# EAGLE design sch (EAGLE 9.4.0)
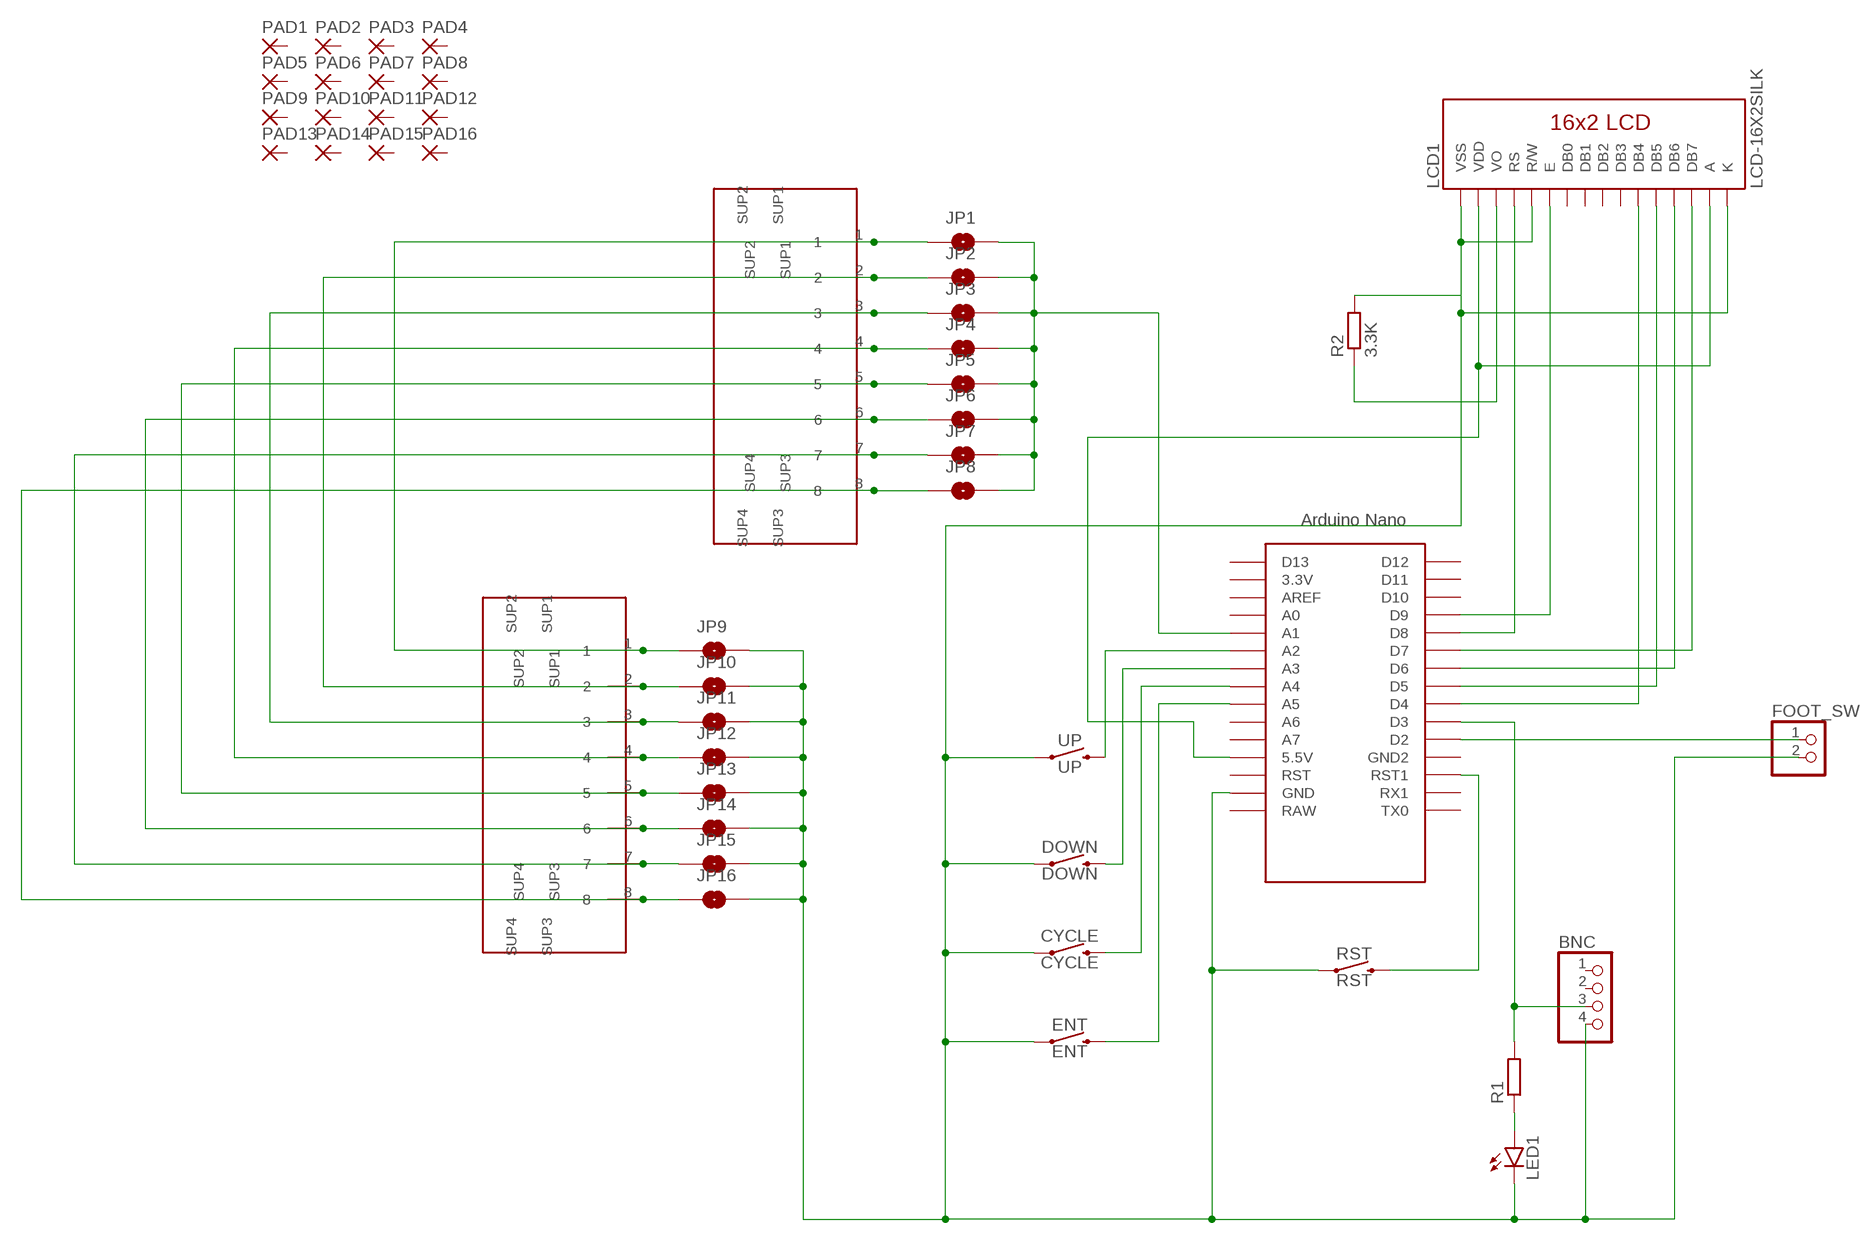
[diagram p0: schematic, sheet 1]

## Parts
BNC  PINHD-1X4  [1X04]
CYCLE  CYCLE  MOMENTARY-SWITCH-SPST-PTH-6.0MM  [TACTILE_SWITCH_PTH_6.0MM]
DOWN  DOWN  MOMENTARY-SWITCH-SPST-PTH-6.0MM  [TACTILE_SWITCH_PTH_6.0MM]
ENT  ENT  MOMENTARY-SWITCH-SPST-PTH-6.0MM  [TACTILE_SWITCH_PTH_6.0MM]
FOOT_SW  PINHD-1X2  [1X02]
JP1  JUMPER-SMT_2_NO_SILK  [SMT-JUMPER_2_NO_SILK]
JP2  JUMPER-SMT_2_NO_SILK  [SMT-JUMPER_2_NO_SILK]
JP3  JUMPER-SMT_2_NO_SILK  [SMT-JUMPER_2_NO_SILK]
JP4  JUMPER-SMT_2_NO_SILK  [SMT-JUMPER_2_NO_SILK]
JP5  JUMPER-SMT_2_NO_SILK  [SMT-JUMPER_2_NO_SILK]
JP6  JUMPER-SMT_2_NO_SILK  [SMT-JUMPER_2_NO_SILK]
JP7  JUMPER-SMT_2_NO_SILK  [SMT-JUMPER_2_NO_SILK]
JP8  JUMPER-SMT_2_NO_SILK  [SMT-JUMPER_2_NO_SILK]
JP9  JUMPER-SMT_2_NO_SILK  [SMT-JUMPER_2_NO_SILK]
JP10  JUMPER-SMT_2_NO_SILK  [SMT-JUMPER_2_NO_SILK]
JP11  JUMPER-SMT_2_NO_SILK  [SMT-JUMPER_2_NO_SILK]
JP12  JUMPER-SMT_2_NO_SILK  [SMT-JUMPER_2_NO_SILK]
JP13  JUMPER-SMT_2_NO_SILK  [SMT-JUMPER_2_NO_SILK]
JP14  JUMPER-SMT_2_NO_SILK  [SMT-JUMPER_2_NO_SILK]
JP15  JUMPER-SMT_2_NO_SILK  [SMT-JUMPER_2_NO_SILK]
JP16  JUMPER-SMT_2_NO_SILK  [SMT-JUMPER_2_NO_SILK]
LAN1  RJ45  [RJ45]
LAN2  RJ45  [RJ45]
LCD1  LCD-16X2SILK  [LCD-16X2]
LED1  LED5MM  [LED5MM]
PAD1  1,6/0,8  [1,6/0,8]
PAD2  1,6/0,8  [1,6/0,8]
PAD3  1,6/0,8  [1,6/0,8]
PAD4  1,6/0,8  [1,6/0,8]
PAD5  1,6/0,8  [1,6/0,8]
PAD6  1,6/0,8  [1,6/0,8]
PAD7  1,6/0,8  [1,6/0,8]
PAD8  1,6/0,8  [1,6/0,8]
PAD9  1,6/0,8  [1,6/0,8]
PAD10  1,6/0,8  [1,6/0,8]
PAD11  1,6/0,8  [1,6/0,8]
PAD12  1,6/0,8  [1,6/0,8]
PAD13  1,6/0,8  [1,6/0,8]
PAD14  1,6/0,8  [1,6/0,8]
PAD15  1,6/0,8  [1,6/0,8]
PAD16  1,6/0,8  [1,6/0,8]
R1  R-EU_0207/7  [0207/7]
R2  3.3K  R-EU_0207/7  [0207/7]
RST  RST  MOMENTARY-SWITCH-SPST-PTH-6.0MM  [TACTILE_SWITCH_PTH_6.0MM]
U$1  NANO  [NANO]
UP  UP  MOMENTARY-SWITCH-SPST-PTH-6.0MM  [TACTILE_SWITCH_PTH_6.0MM]

## Nets
N$1: LCD1.4(RS) U$1.D8
N$2: LCD1.6(E) U$1.D9
N$3: LCD1.11(DB4) U$1.D4
N$4: LCD1.12(DB5) U$1.D5
N$5: LCD1.13(DB6) U$1.D6
N$6: LCD1.14(DB7) U$1.D7
N$7: BNC.3 R1.2 U$1.D3
N$8: LED1.A R1.1
N$9: U$1.A2 UP.3
N$10: JP1.2 JP2.2 JP3.2 JP4.2 JP5.2 JP6.2 JP7.2 JP8.2 U$1.A1
N$11: FOOT_SW.1 U$1.D2
N$12: LCD1.2(VDD) LCD1.15(A) U$1.5V(5.5V)
N$13: DOWN.3 U$1.A3
N$14: CYCLE.3 U$1.A4
N$15: ENT.3 U$1.A5
N$16: BNC.4 CYCLE.1 DOWN.1 ENT.1 FOOT_SW.2 JP9.2 JP10.2 JP11.2 JP12.2 JP13.2 JP14.2 JP15.2 JP16.2 LCD1.1(VSS) LCD1.5(R/W) LCD1.16(K) LED1.K(C) R2.2 RST.1 U$1.GND UP.1
N$17: RST.3 U$1.RST1
N$19: JP2.1 JP10.1 LAN1.2 LAN2.2
N$20: JP3.1 JP11.1 LAN1.3 LAN2.3
N$21: JP4.1 JP12.1 LAN1.4 LAN2.4
N$22: JP5.1 JP13.1 LAN1.5 LAN2.5
N$23: JP6.1 JP14.1 LAN1.6 LAN2.6
N$24: JP7.1 JP15.1 LAN1.7 LAN2.7
N$25: JP8.1 JP16.1 LAN1.8 LAN2.8
N$26: JP1.1 JP9.1 LAN1.1 LAN2.1
N$36: LCD1.3(VO) R2.1
Unconnected: BNC.1 BNC.2 LAN1.SUP1 LAN1.SUP2 LAN1.SUP3 LAN1.SUP4 LAN2.SUP1 LAN2.SUP2 LAN2.SUP3 LAN2.SUP4 LCD1.7(DB0) LCD1.8(DB1) LCD1.9(DB2) LCD1.10(DB3) PAD1.1(P) PAD2.1(P) PAD3.1(P) PAD4.1(P) PAD5.1(P) PAD6.1(P) PAD7.1(P) PAD8.1(P) PAD9.1(P) PAD10.1(P) PAD11.1(P) PAD12.1(P) PAD13.1(P) PAD14.1(P) PAD15.1(P) PAD16.1(P) U$1.3.3V U$1.A0 U$1.A6 U$1.A7 U$1.AREF U$1.D10 U$1.D11 U$1.D12 U$1.D13 U$1.GND1(GND2) U$1.ICSP1 U$1.ICSP2 U$1.ICSP3 U$1.ICSP4 U$1.ICSP5 U$1.ICSP6 U$1.RAW U$1.RST U$1.RX1 U$1.TX0

## Library data of the parts
BNC = pinhead:PINHD-1X4: PIN HEADER
CYCLE DOWN ENT RST UP = SparkFun-Switches:MOMENTARY-SWITCH-SPST: Momentary Switch (Pushbutton) - SPST Normally-open (NO) SPST momentary switches (buttons, pushbuttons). Variants PTH-12MM - 12mm square, through-hole Momentary Pushbutton Switch - 12mm Square <https://www.sparkfun.com/products/9190> (COM-09190) PTH-6.0MM, PTH-6.0MM-KIT - 6.0mm square, through-hole Mini Pushbutton Switch <https://www.sparkfun.com/products/97> (COM-00097) KIT package intended for soldering kit's - only one side of pads' copper is exposed. PTH-RIGHT-ANGLE-KIT - Right-angle, through-hole Right Angle Tactile Button <https://www.sparkfun.com/products/10791> - Used on SparkFun BigTime Watch Kit <https://www.sparkfun.com/products/11734> SMD-12MM - 12mm square, surface-mount Tactile Button - SMD (12mm) <https://www.sparkfun.com/products/12993> (COM-12993) Used on SparkFun PicoBoard <https://www.sparkfun.com/products/11888> SMD-4.5MM - 4.5mm Square Trackball Switch Used on SparkFun Blackberry Trackballer Breakout <https://www.sparkfun.com/products/13169> SMD-4.6MMX2.8MM - 4.60mm x 2.80mm, surface mount Used on SparkFun SAMD21 Mini Breakout <https://www.sparkfun.com/products/13664> SMD-5.2MM, SMD-5.2-REDUNDANT - 5.2mm square, surface-mount Mini Pushbutton Switch - SMD <https://www.sparkfun.com/products/8720> (COM-08720) Used on Arduino Pro Mini <https://www.sparkfun.com/products/11114> REDUNDANT package connects both switch circuits together SMD-6.0X3.5MM - 6.0 x 3.5mm, surface mount Momentary Reset Switch SMD <https://www.sparkfun.com/products/8229> (COM-08229) SMD-6.2MM-TALL - 6.2mm square, surface mount Tactile Button - SMD (6mm) <https://www.sparkfun.com/products/12992> Used on SparkFun Digital Sandbox <https://www.sparkfun.com/products/12651> SMD-RIGHT-ANGLE - Right-angle, surface mount Used on SparkFun Block for Intel® Edison - Arduino <https://www.sparkfun.com/products/13036>; PROD_ID: SWCH-08441; SF_SKU: COM-00097
FOOT_SW = pinhead:PINHD-1X2: PIN HEADER
JP1-JP16 = SparkFun-Jumpers:JUMPER-SMT_2_NO: Normally open jumper This jumper has two pads in close proximity to each other. Apply solder to close the connection. Round pads are easier to solder for beginners, but are a lot larger. SparkFun Product that uses the round pads: SparkFun EL Sequencer <https://www.sparkfun.com/products/12781>
LAN1 LAN2 = rj45:RJ45
LCD1 = SparkFun-Displays:LCD-16X2: Standard text-only 16x2 parallel input LCD Basic 16 character by 2 line display. Typically utilizes the extremely common HD44780 parallel interface chipset SparkFun Products: Basic 16x2 Green <https://www.sparkfun.com/products/255> Basic 8x2 Green <https://www.sparkfun.com/products/11122>; SF_ID: LCD-00255
LED1 = led:LED: LED OSRAM: - CHIPLED LG R971, LG N971, LY N971, LG Q971, LY Q971, LO R971, LY R971 LH N974, LH R974 LS Q976, LO Q976, LY Q976 LO Q996 - Hyper CHIPLED LW Q18S LB Q993, LB Q99A, LB R99A - SideLED LS A670, LO A670, LY A670, LG A670, LP A670 LB A673, LV A673, LT A673, LW A673 LH A674 LY A675 LS A676, LA A676, LO A676, LY A676, LW A676 LS A679, LY A679, LG A679 - Hyper Micro SIDELED® LS Y876, LA Y876, LO Y876, LY Y876 LT Y87S - SmartLED LW L88C, LW L88S LB L89C, LB L89S, LG L890 LS L89K, LO L89K, LY L89K LS L896, LA L896, LO L896, LY L896 - TOPLED LS T670, LO T670, LY T670, LG T670, LP T670 LSG T670, LSP T670, LSY T670, LOP T670, LYG T670 LG T671, LOG T671, LSG T671 LB T673, LV T673, LT T673, LW T673 LH T674 LS T676, LA T676, LO T676, LY T676, LB T676, LH T676, LSB T676, LW T676 LB T67C, LV T67C, LT T67C, LS T67K, LO T67K, LY T67K, LW E67C LS E67B, LA E67B, LO E67B, LY E67B, LB E67C, LV E67C, LT E67C LW T67C LS T679, LY T679, LG T679 LS T770, LO T770, LY T770, LG T770, LP T770 LB T773, LV T773, LT T773, LW T773 LH T774 LS E675, LA E675, LY E675, LS T675 LS T776, LA T776, LO T776, LY T776, LB T776 LHGB T686 LT T68C, LB T68C - Hyper Mini TOPLED® LB M676 - Mini TOPLED Santana® LG M470 LS M47K, LO M47K, LY M47K Source: http://www.osram.convergy.de LUXEON: - LUMILED® LXK2-PW12-R00, LXK2-PW12-S00, LXK2-PW14-U00, LXK2-PW14-V00 LXK2-PM12-R00, LXK2-PM12-S00, LXK2-PM14-U00 LXK2-PE12-Q00, LXK2-PE12-R00, LXK2-PE12-S00, LXK2-PE14-T00, LXK2-PE14-U00 LXK2-PB12-K00, LXK2-PB12-L00, LXK2-PB12-M00, LXK2-PB14-N00, LXK2-PB14-P00, LXK2-PB14-Q00 LXK2-PR12-L00, LXK2-PR12-M00, LXK2-PR14-Q00, LXK2-PR14-R00 LXK2-PD12-Q00, LXK2-PD12-R00, LXK2-PD12-S00 LXK2-PH12-R00, LXK2-PH12-S00 LXK2-PL12-P00, LXK2-PL12-Q00, LXK2-PL12-R00 Source: www.luxeon.com KINGBRIGHT: KA-3528ASYC Source: www.kingbright.com
PAD1-PAD16 = wirepad:1,6/0,8: THROUGH-HOLE PAD
R1 R2 = resistor:R-EU_: RESISTOR, European symbol
U$1 = Arduino-clone:NANO: Arduino Nano

## Net classes
0 default: width 0.254 mm, clearance 0.254 mm

## Board
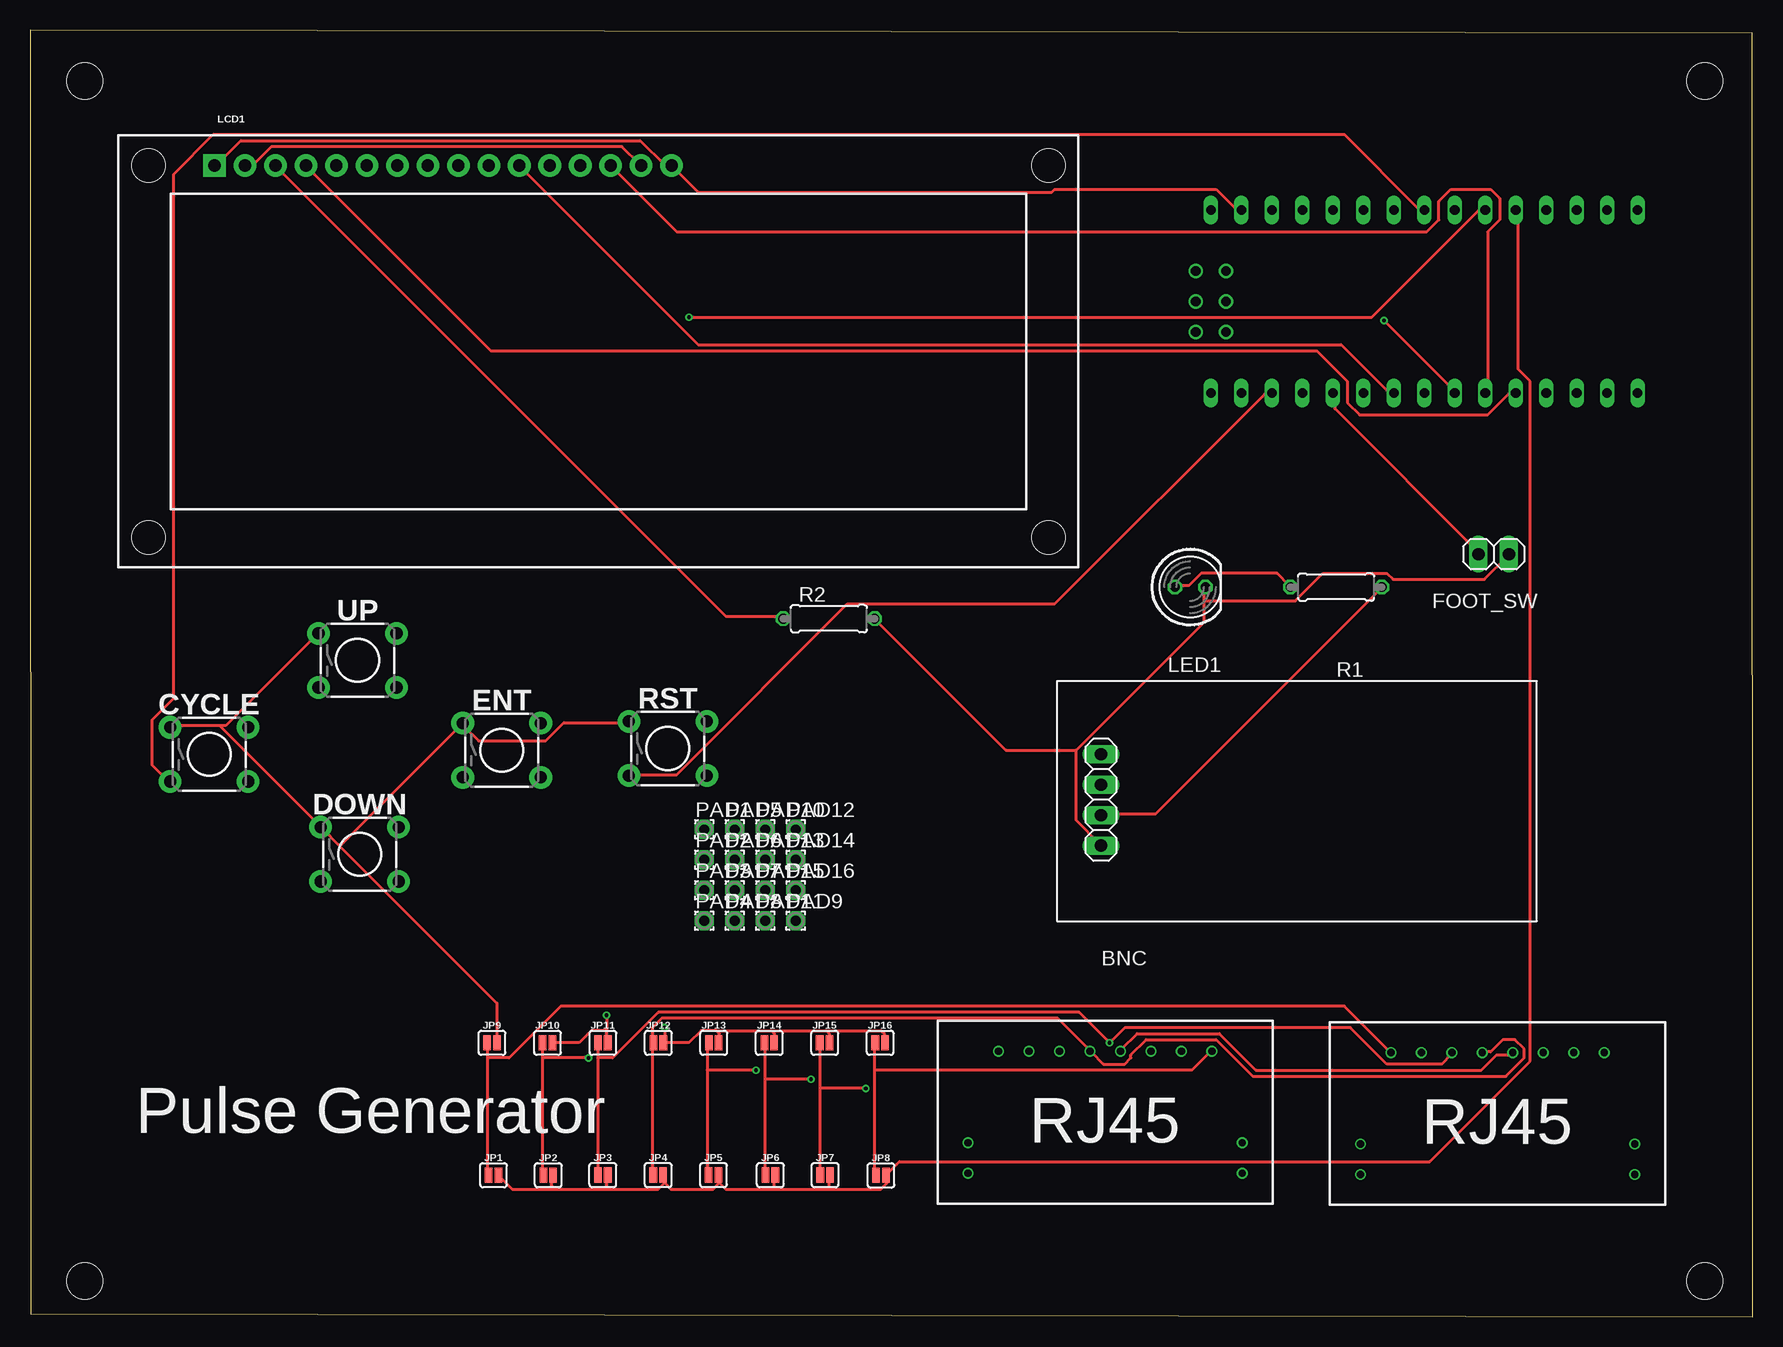
[diagram p1: board, top side]
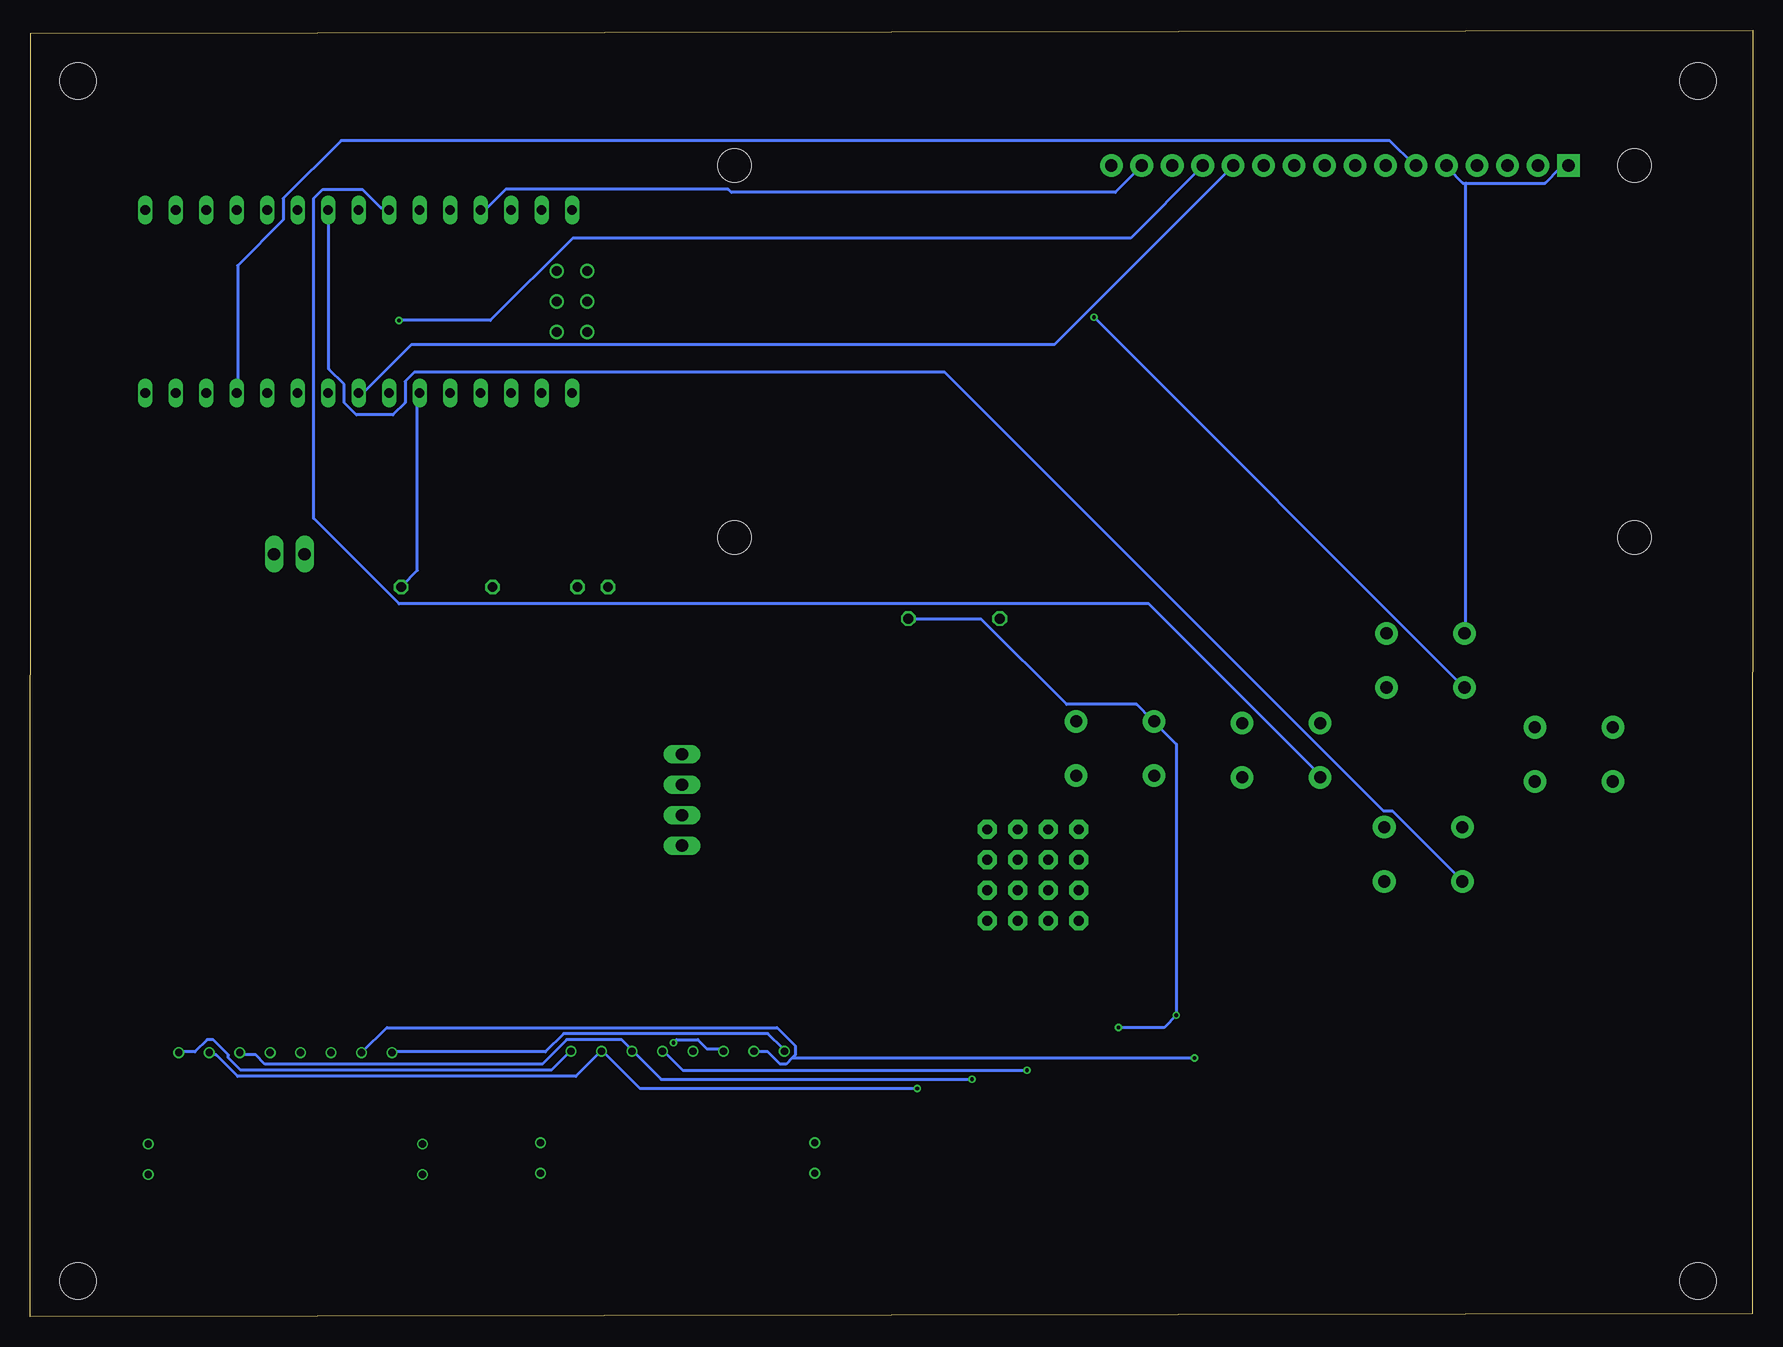
[diagram p2: board, bottom side, seen from below]

Size 143.58 x 107.22 mm. Coordinates in mm from the lower left corner, seen from the top.
Outline: 0.05,0.25 143.58,0 143.53,106.97 0,107.22 0.05,0.25
Copper layers (1*16): Top 0.035mm / dielectric 1.6mm / Bottom 0.035mm
Design rules "Elecrow_2-layer_PCB_eagle_rule": minimum track width 6mil, minimum drill 12mil, track to track 6mil, track to pad 6mil, pad to pad 6mil, via to via 8mil, smd to smd 0mil, copper to edge 20mil, drill to drill 10mil, minimum pad ring 6mil, minimum via ring 6mil, stop-mask expansion 0mil, vias tented up to drill 100mil, thermal gap 10mil
Holes 3 mm at 4.57,102.97 4.57,2.97 139.57,102.97 139.57,2.97

### Footprints (pad centres in the part's own frame; a part is rotated, then mirrored left to right if it is on the bottom)
1X04 = drill 1.016 long: 1 -3.81,0; 2 -1.27,0; 3 1.27,0; 4 3.81,0
TACTILE_SWITCH_PTH_6.0MM = drill 1.016 pad 1.88: 1 -3.251,2.261; 2 3.251,2.261; 3 -3.251,-2.261; 4 3.251,-2.261
1X02 = drill 1.016 long: 1 -1.27,0; 2 1.27,0
SMT-JUMPER_2_NO_SILK = smd 0.635 x 1.27: 1 -0.406,0; 2 0.406,0
RJ45 = drill 0.6: 1 2.54,2.54; 2 5.08,2.54; 3 7.62,2.54; 4 10.16,2.54; 5 12.7,2.54; 6 15.24,2.54; 7 17.78,2.54; 8 20.32,2.54; SUP1 0,-5.08; SUP2 0,-7.62; SUP3 22.86,-5.08; SUP4 22.86,-7.62
LCD-16X2 = drill 1.016 pad 1.88 square: 1 -32,15.5 | drill 1.016 pad 1.88: 2 -29.46,15.5; 3 -26.92,15.5; 4 -24.38,15.5; 5 -21.84,15.5; 6 -19.3,15.5; 7 -16.76,15.5; 8 -14.22,15.5; 9 -11.68,15.5; 10 -9.14,15.5; 11 -6.6,15.5; 12 -4.06,15.5; 13 -1.52,15.5; 14 1.02,15.5; 15 3.56,15.5; 16 6.1,15.5 | hole 2.8: -37.5,15.5; -37.5,-15.5; 37.5,15.5; 37.5,-15.5
LED5MM = drill 0.813 octagon: A -1.27,0; K 1.27,0
1,6/0,8 = drill 0.813 pad 1.6 octagon: 1 0,0
0207/7 = drill 0.813 octagon: 1 -3.81,0; 2 3.81,0
NANO = drill 0.8 long: 3.3V -10.16,24.13; 5V -10.16,-1.27; A0 -10.16,19.05; A1 -10.16,16.51; A2 -10.16,13.97; A3 -10.16,11.43; A4 -10.16,8.89; A5 -10.16,6.35; A6 -10.16,3.81; A7 -10.16,1.27; AREF -10.16,21.59; D2 5.08,1.27; D3 5.08,3.81; D4 5.08,6.35; D5 5.08,8.89; D6 5.08,11.43; D7 5.08,13.97; D8 5.08,16.51; D9 5.08,19.05; D10 5.08,21.59; D11 5.08,24.13; D12 5.08,26.67; D13 -10.16,26.67; GND -10.16,-6.35; GND1 5.08,-1.27; RAW -10.16,-8.89; RST -10.16,-3.81; RST1 5.08,-3.81; RX1 5.08,-6.35; TX0 5.08,-8.89 | drill 0.8: ICSP1 -5.08,-10.16; ICSP2 -5.08,-7.62; ICSP3 -2.54,-10.16; ICSP4 -2.54,-7.62; ICSP5 0,-10.16; ICSP6 0,-7.62

### Placement (x,y rotation side)
BNC  89.24,43.07 270 top
CYCLE  14.93,46.86 0 top
DOWN  27.47,38.53 0 top
ENT  39.31,47.2 0 top
FOOT_SW  121.97,63.55 0 top
JP1  38.63,11.79 0 top
JP2  43.18,11.79 0 top
JP3  47.73,11.8 0 top
JP4  52.35,11.8 0 top
JP5  56.96,11.8 0 top
JP6  61.7,11.8 0 top
JP7  66.26,11.8 0 top
JP8  70.92,11.78 0 top
JP9  38.5,22.82 0 top
JP10  43.12,22.82 0 top
JP11  47.74,22.82 0 top
JP12  52.36,22.82 0 top
JP13  56.98,22.82 0 top
JP14  61.6,22.82 0 top
JP15  66.22,22.82 0 top
JP16  70.84,22.82 0 top
LAN1  110.87,19.47 0 top
LAN2  78.17,19.57 0 top
LCD1  47.37,80.44 0 top
LED1  96.68,60.8 0 top
PAD1  56.18,40.61 0 top
PAD2  56.18,38.07 0 top
PAD3  56.18,35.53 0 top
PAD4  56.18,32.99 0 top
PAD5  58.72,40.61 0 top
PAD6  58.72,38.07 0 top
PAD7  58.72,35.53 0 top
PAD8  58.72,32.99 0 top
PAD9  63.8,32.99 0 top
PAD10  61.26,40.61 0 top
PAD11  61.26,32.99 0 top
PAD12  63.8,40.61 0 top
PAD13  61.26,38.07 0 top
PAD14  63.8,38.07 0 top
PAD15  61.26,35.53 0 top
PAD16  63.8,35.53 0 top
R1  108.84,60.8 0 top
R2  66.57,58.17 0 top
RST  53.15,47.35 0 top
U$1  107.3,82.06 270 top
UP  27.29,54.69 0 top

### Tracks (layer width: path | path; a pad name or v marks a point on that pad's centre or on a via)
N$1
  Top 0.254: U$1.D8 123.75,76.93 123.24,76.93 121.46,75.15 110.79,75.15 109.78,76.17 109.78,77.95 107.24,80.49 38.4,80.49 23.16,95.73 LCD1.4
N$2
  Bottom 0.254: U$1.D9 126.29,77.18 126.29,87.6 122.48,91.41 122.48,93.19 117.65,98.01 30.27,98.01 28.24,95.98 LCD1.6
N$3
  Top 0.254: U$1.D4 113.59,77.18 113.08,77.18 109.27,80.99 55.67,80.99 40.94,95.73 LCD1.11
N$4
  Bottom 0.254: U$1.D5 116.13,77.18 115.62,77.18 111.81,80.99 58.21,80.99 43.48,95.73 LCD1.12
N$5  (via drill 0.3)
  Top 0.254: v112.82,83.03 118.67,77.18 U$1.D6
  Bottom 0.254: v112.82,83.03 105.2,83.03 98.35,89.88 51.86,89.88 46.02,95.73 LCD1.13
N$6
  Top 0.254: U$1.D7 121.46,77.18 121.46,90.39 122.48,91.41 122.48,93.19 121.71,93.95 118.41,93.95 117.4,92.93 117.4,91.41 116.38,90.39 53.9,90.39 48.56,95.73 LCD1.14
N$7
  Top 0.254: BNC.3 89.46,41.88 93.77,41.88 112.57,60.68 R1.2
  Bottom 0.254: U$1.D3 111.3,76.93 111.3,62.2 112.57,60.93 R1.2
N$8
  Top 0.254: LED1.A 95.55,60.93 96.57,60.93 97.58,61.95 103.93,61.95 104.95,60.93 R1.1
N$9  (via drill 0.3)
  Top 0.254: v54.91,83.28 111.81,83.28 120.7,92.17 121.21,92.17 U$1.A2
  Bottom 0.254: v54.91,83.28 24.18,52.55 UP.3
N$10
  Top 0.254: 43.23,10.64 43.48,10.89 43.48,11.65 JP2.2 | 43.23,10.64 40.18,10.64 39.16,11.65 JP1.2 | 47.8,10.64 48.05,10.89 48.05,11.65 JP3.2 | 43.23,10.64 47.8,10.64 | 52.88,11.14 52.88,11.65 JP4.2 | 52.88,11.14 52.37,10.64 47.8,10.64 | 57.45,11.14 57.45,11.65 JP5.2 | 57.45,11.14 56.94,10.64 53.39,10.64 52.88,11.14 | 61.77,10.64 62.02,10.89 62.02,11.65 JP6.2 | 61.77,10.64 57.96,10.64 57.45,11.14 | 66.34,10.64 66.6,10.89 66.6,11.65 JP7.2 | 61.77,10.64 66.34,10.64 | 66.34,10.64 70.91,10.64 71.42,11.14 71.42,11.65 JP8.2 71.42,11.91 72.44,12.92 116.63,12.92 125.02,21.3 125.02,77.95 124,78.96 124,92.17 U$1.A1
N$11
  Top 0.254: U$1.D2 108.76,76.93 108.76,75.66 120.7,63.72 FOOT_SW.1
N$12
  Top 0.254: LCD1.2 18.08,95.98 18.59,95.98 20.11,97.5 49.32,97.5 50.85,95.98 LCD1.15
  Bottom 0.254: U$1.5V 105.97,92.42 105.46,92.42 103.93,93.95 85.39,93.95 85.14,93.69 53.13,93.69 51.1,95.73 LCD1.15
N$13
  Bottom 0.254: U$1.A3 118.67,92.17 118.67,78.96 117.4,77.69 117.4,76.17 116.38,75.15 113.33,75.15 112.32,76.17 112.32,77.95 111.55,78.71 67.36,78.71 30.78,42.13 30.02,42.13 24.18,36.29 DOWN.3
N$14
  Top 0.254: U$1.A4 116.13,92.42 115.62,92.42 109.52,98.52 15.29,98.52 11.99,95.22 11.99,51.53 10.21,49.75 10.21,45.94 11.48,44.67 CYCLE.3
N$15
  Bottom 0.254: U$1.A5 113.84,92.42 114.35,92.42 115.87,93.95 119.17,93.95 119.94,93.19 119.94,66.52 112.82,59.41 50.34,59.41 36.12,45.18 ENT.3
N$16  (via drill 0.3)
  Top 0.254: 97.84,59.66 97.84,57.88 87.17,47.21 | 97.84,59.66 97.84,60.68 LED1.K | 87.17,47.21 87.17,41.37 89.2,39.34 BNC.4 | 97.84,59.66 105.46,59.66 107.74,61.95 113.08,61.95 113.59,61.44 121.21,61.44 123.24,63.47 FOOT_SW.2 | 52.88,22.83 54.91,22.83 55.93,23.85 57.2,23.85 | 57.2,23.85 57.45,23.59 57.45,22.83 JP13.2 | 61.77,23.85 62.02,23.59 62.02,22.83 JP14.2 | 57.2,23.85 61.77,23.85 | 66.34,23.85 66.6,23.59 66.6,22.83 JP15.2 | 61.77,23.85 66.34,23.85 | 66.34,23.85 70.91,23.85 71.17,23.59 71.17,22.83 JP16.2 | 48.05,23.85 46.78,23.85 45.77,22.83 43.74,22.83 JP10.2 | 48.05,23.85 48.05,22.83 JP11.2 | v48.05,25.12 48.05,23.85 | v52.88,24.1 52.88,22.83 | 52.88,22.83 JP12.2 | 87.17,47.21 81.33,47.21 70.41,58.13 R2.2 | U$1.GND 100.89,92.42 100.38,92.42 98.85,93.95 85.39,93.95 85.14,93.69 55.67,93.69 53.64,95.73 LCD1.16 53.39,95.98 52.88,95.98 50.85,98.01 17.57,98.01 15.54,95.98 LCD1.1 | JP9.2 38.91,26.13 25.7,39.34 | 25.7,39.34 24.43,40.61 DOWN.1 24.18,40.86 15.8,49.25 | 25.7,39.34 25.96,39.34 35.86,49.25 ENT.1 36.12,49.25 37.39,47.98 42.97,47.98 44.5,49.5 49.83,49.5 RST.1 | 15.8,49.25 16.3,49.25 23.92,56.87 UP.1 | 15.8,49.25 11.73,49.25 CYCLE.1
  Bottom 0.254: R2.2 70.15,58.13 64.31,58.13 57.2,51.02 51.36,51.02 50.09,49.75 RST.1 49.83,49.5 48.05,47.72 v48.05,25.12 49.07,24.1 v52.88,24.1 | 23.92,94.46 24.18,94.46 25.45,95.73 LCD1.5 | 23.92,94.46 17.32,94.46 16.05,95.73 15.54,95.73 LCD1.1 | 23.92,94.46 23.92,57.12 UP.1
N$17
  Top 0.254: U$1.RST1 103.43,76.93 102.92,76.93 85.39,59.41 68.12,59.41 53.9,45.18 50.09,45.18 RST.3
N$19  (via drill 0.3)
  Top 0.254: 42.72,21.56 42.72,11.91 JP2.1 | 42.72,21.56 42.72,22.58 JP10.1 | v46.53,21.56 42.72,21.56
  Bottom 0.254: 80.06,21.56 79.8,21.81 79.8,22.58 81.33,24.1 113.84,24.1 115.87,22.07 LAN1.2 | 80.06,21.56 80.57,21.05 81.07,21.05 82.09,22.07 83.11,22.07 LAN2.2 | 80.06,21.56 v46.53,21.56
N$20  (via drill 0.3)
  Top 0.254: 47.29,21.56 47.29,22.58 JP11.1 | 47.29,21.56 47.29,11.91 JP3.1 | LAN1.3 118.41,21.81 117.65,21.05 113.08,21.05 110.03,24.1 91.23,24.1 v89.96,22.83 87.42,25.37 52.37,25.37 48.56,21.56 47.29,21.56
  Bottom 0.254: v89.96,22.83 89.71,23.08 87.93,23.08 87.17,22.32 85.9,22.32 LAN2.3
N$21
  Top 0.254: JP4.1 51.86,11.91 51.86,22.58 JP12.1 51.86,22.83 51.86,24.1 52.63,24.86 85.65,24.86 88.19,22.32 LAN2.4 88.44,22.07 89.46,21.05 91.23,21.05 91.74,21.56 91.74,21.81 93.01,23.08 98.85,23.08 101.9,20.04 122.98,20.04 124.51,21.56 124.51,22.32 123.75,23.08 122.73,23.08 121.71,22.07 121.21,22.07 LAN1.4
N$22  (via drill 0.3)
  Top 0.254: 56.44,20.54 56.44,22.58 JP13.1 | 56.44,20.54 56.44,11.91 JP5.1 | LAN1.5 123.49,21.81 122.22,21.81 120.95,20.54 102.16,20.54 99.11,23.59 92.25,23.59 90.98,22.32 LAN2.5 | v60.5,20.54 56.44,20.54
  Bottom 0.254: v60.5,20.54 89.2,20.54 90.73,22.07 LAN2.5
N$23  (via drill 0.3)
  Top 0.254: 61.26,19.78 61.26,11.91 JP6.1 | 61.26,19.78 61.26,22.58 JP14.1 | v65.07,19.78 61.26,19.78
  Bottom 0.254: LAN1.6 126.03,21.81 124.76,21.81 124,21.05 100.89,21.05 98.85,23.08 94.28,23.08 93.52,22.32 LAN2.6 93.27,22.07 90.98,19.78 v65.07,19.78
N$24  (via drill 0.3)
  Top 0.254: 65.83,19.02 65.83,11.91 JP7.1 | 65.83,19.02 65.83,22.58 JP15.1 | v69.64,19.02 65.83,19.02
  Bottom 0.254: LAN1.7 128.57,21.81 128.06,21.81 126.29,20.04 98.09,20.04 96.06,22.07 LAN2.7 95.81,22.07 92.76,19.02 v69.64,19.02
N$25
  Top 0.254: 70.41,20.54 70.41,11.91 JP8.1 | 70.41,20.54 70.41,22.58 JP16.1 | 70.41,20.54 96.82,20.54 98.35,22.07 LAN2.8
  Bottom 0.254: LAN1.8 131.11,22.07 129.84,22.07 128.83,23.08 128.32,23.08 127.05,21.81 127.05,21.56 126.03,20.54 100.12,20.54 98.6,22.07 LAN2.8
N$26
  Top 0.254: 38.15,21.56 38.15,11.91 JP1.1 | 38.15,21.56 38.15,22.58 JP9.1 | 38.15,21.56 39.93,21.56 44.24,25.88 109.52,25.88 113.33,22.07 LAN1.1
  Bottom 0.254: LAN1.1 113.33,22.07 100.63,22.07 99.11,23.59 82.09,23.59 80.82,22.32 LAN2.1
N$36
  Top 0.254: R2.1 62.53,58.39 57.96,58.39 20.62,95.73 LCD1.3

### Text on the board
tNames: Pulse Generator